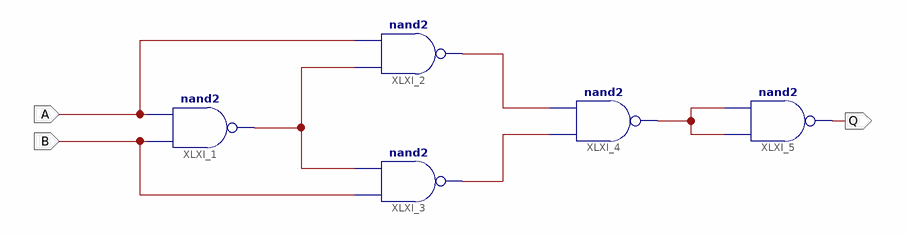
[diagram p0: schematic sheet 1]
// Xilinx ISE schematic Lab4Exp2.sch (spartan3e) as structural Verilog: 5 symbols, 3 ports
module Lab4Exp2 (
  input  A,
  input  B,
  output Q
);

  wire XLXN_4, XLXN_8, XLXN_9, XLXN_10;

  nand XLXI_1 (XLXN_4, B, A);
  nand XLXI_2 (XLXN_8, XLXN_4, A);
  nand XLXI_3 (XLXN_9, B, XLXN_4);
  nand XLXI_4 (XLXN_10, XLXN_9, XLXN_8);
  nand XLXI_5 (Q, XLXN_10, XLXN_10);
endmodule
